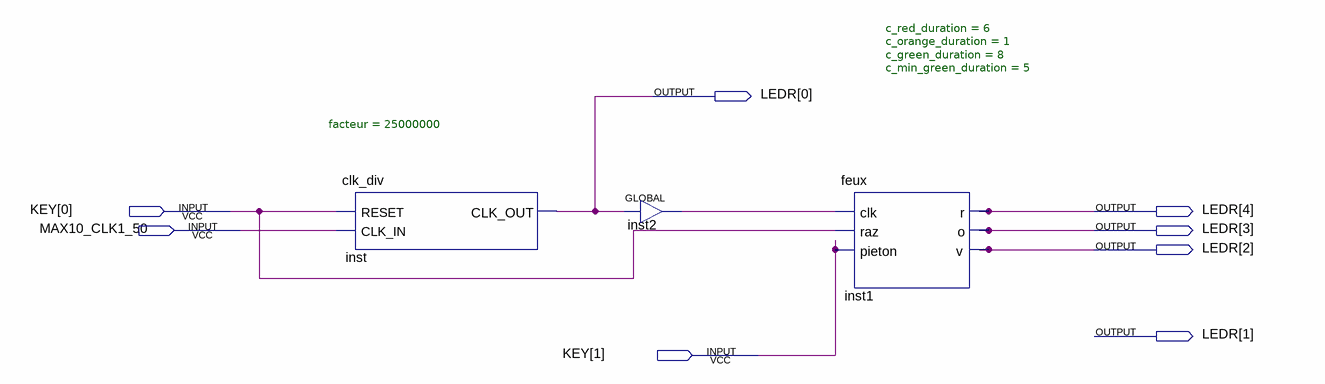
[diagram p0: schematic sheet]
// Quartus schematic feux_signalisation.bdf as structural Verilog: 3 symbols, 8 pins
module feux_signalisation (
  input  [1:0] KEY,
  input  MAX10_CLK1_50,
  output [4:0] LEDR
);

  wire inst2_out;

  clk_div #(.facteur(25000000)) inst (.RESET(KEY[0]), .CLK_IN(MAX10_CLK1_50), .CLK_OUT(LEDR[0]));
  GLOBAL inst2 (.IN(LEDR[0]), .OUT(inst2_out));
  feux #(.c_red_duration(6), .c_orange_duration(1), .c_green_duration(8), .c_min_green_duration(5)) inst1 (
    .clk(inst2_out), .raz(KEY[0]), .pieton(KEY[1]), .r(LEDR[4]), .o(LEDR[3]), .v(LEDR[2]));
endmodule
